# EAGLE design rda5807m (EAGLE 9.6.2)
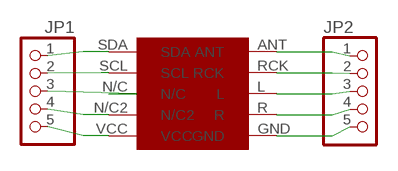
[diagram p0: schematic, sheet 1]

## Parts
JP1  PINHD-1X5  [1X05]
JP2  PINHD-1X5  [1X05]
U$1  RDA  [RDA]

## Nets
GND: JP2.5 U$1.GND
N$1: JP1.1 U$1.SDA
N$2: JP1.2 U$1.SCL
N$3: JP1.3 U$1.N/C
N$4: JP1.4 U$1.N/C2
N$5: JP1.5 U$1.VCC
N$6: JP2.4 U$1.R
N$7: JP2.3 U$1.L
N$8: JP2.2 U$1.RCK
N$9: JP2.1 U$1.ANT

## Library data of the parts
JP1 JP2 = pinhead:PINHD-1X5: PIN HEADER
U$1 = RDA:RDA

## Board
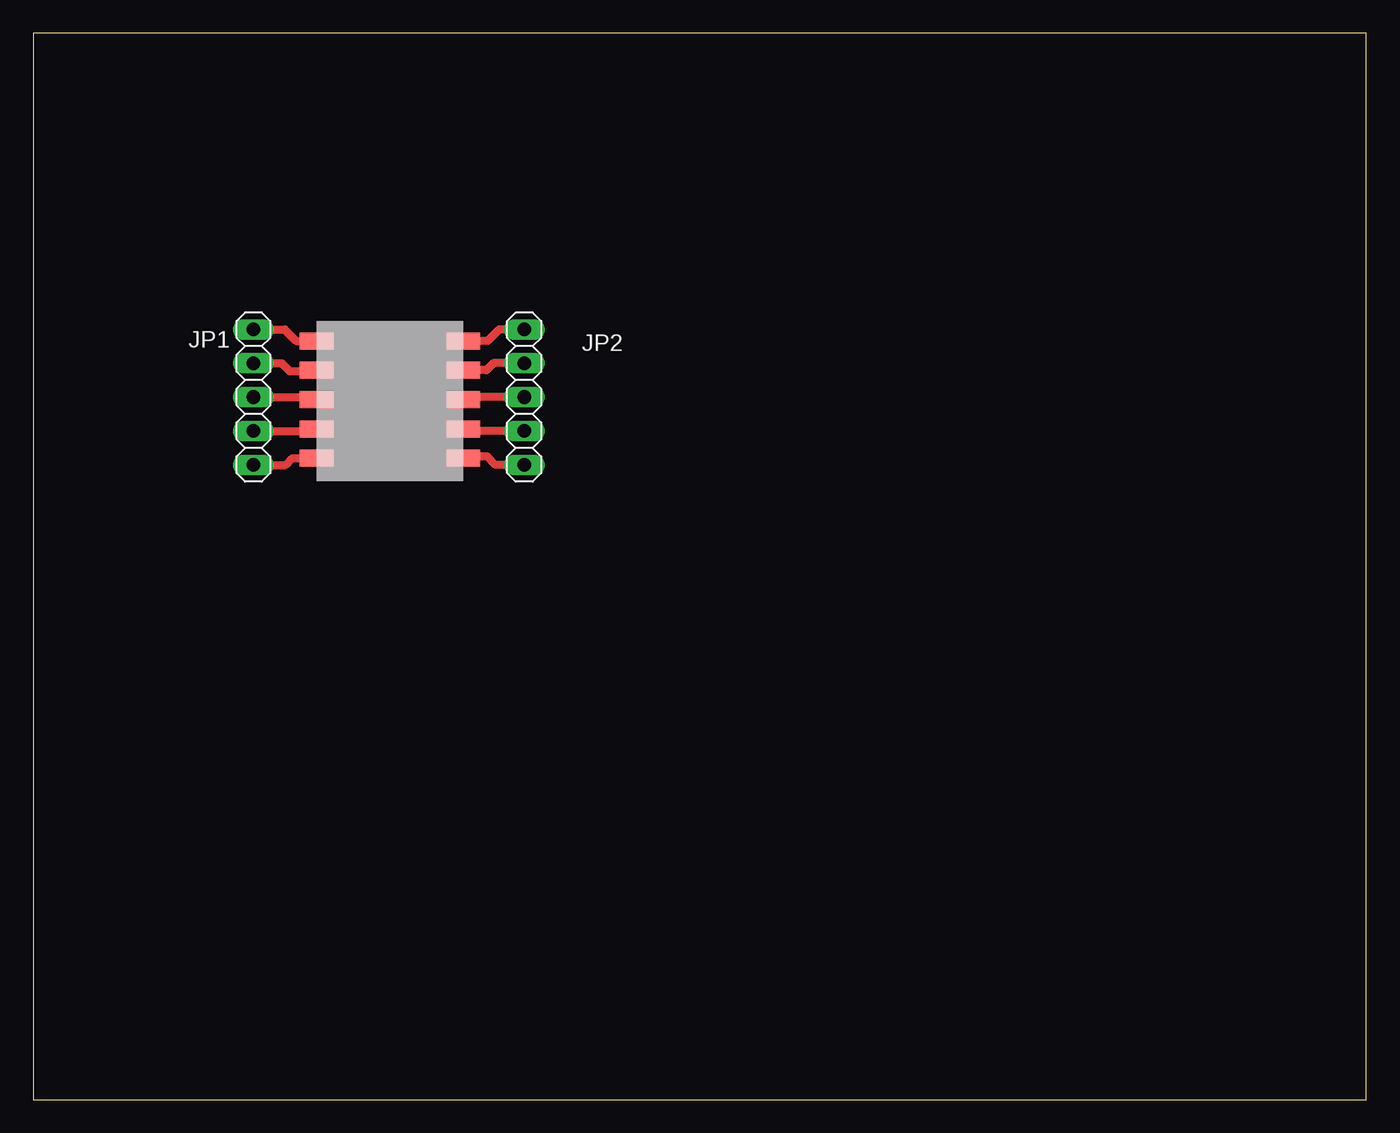
[diagram p1: board, top side]

Size 100 x 80 mm. Coordinates in mm from the lower left corner, seen from the top.
Outline: 0,0 100,0 100,80 0,80 0,0
Copper layers (1*16): Top 0.035mm / dielectric 1.5mm / Bottom 0.035mm
Design rules "default": minimum track width 6mil, minimum drill 0.35mm, track to track 6mil, track to pad 6mil, pad to pad 6mil, via to via 6mil, smd to smd 6mil, copper to edge 40mil, drill to drill 6mil, minimum pad ring 10mil, minimum via ring 8mil, stop-mask expansion 4mil, vias tented up to drill 0mil, thermal gap 10mil

### Footprints (pad centres in the part's own frame; a part is rotated, then mirrored left to right if it is on the bottom)
1X05 = drill 1.016 long: 1 -5.08,0; 2 -2.54,0; 3 0,0; 4 2.54,0; 5 5.08,0
RDA = smd 2.54 x 1.27: ANT 11,-1.5; GND 11,-10.3; L 11,-5.9; N/C 0,-5.9; N/C2 0,-8.1; R 11,-8.1; RCK 11,-3.7; SCL 0,-3.7; SDA 0,-1.5; VCC 0,-10.3

### Placement (x,y rotation side)
JP1  16.51,52.7 270 top
JP2  36.83,52.7 270 top
U$1  21.26,58.42 0 top

### Tracks (layer width: path | path; a pad name or v marks a point on that pad's centre or on a via)
GND
  Top 0.152: 33.06,48.23 32.95,48.12 U$1.GND
  Top 0.61: JP2.5 34.7,47.62 34.09,48.23 33.06,48.23
N$1
  Top 0.61: JP1.1 18.87,57.78 19.74,56.92 U$1.SDA
N$2
  Top 0.152: U$1.SCL 21.18,54.63
  Top 0.61: 21.18,54.63 19.25,54.63 18.64,55.24 JP1.2
N$3
  Top 0.152: 21.07,52.7 U$1.N/C
  Top 0.61: JP1.3 21.07,52.7
N$4
  Top 0.152: 20.3,50.16 20.73,50.6 20.98,50.6 U$1.N/C2
  Top 0.61: JP1.4 20.3,50.16
N$5
  Top 0.61: JP1.5 18.94,47.62 19.43,48.12 U$1.VCC
N$6
  Top 0.152: 32.41,50.16 U$1.R
  Top 0.61: JP2.4 32.41,50.16
N$7
  Top 0.152: 32.45,52.7 U$1.L
  Top 0.61: JP2.3 32.45,52.7
N$8
  Top 0.61: JP2.2 34.52,55.24 33.99,54.72 U$1.RCK
N$9
  Top 0.61: JP2.1 34.95,57.78 34.09,56.92 U$1.ANT